# Altium schematic sheet 07_MOTOR_DRIVER_INTERFACE.SchDoc
size A4
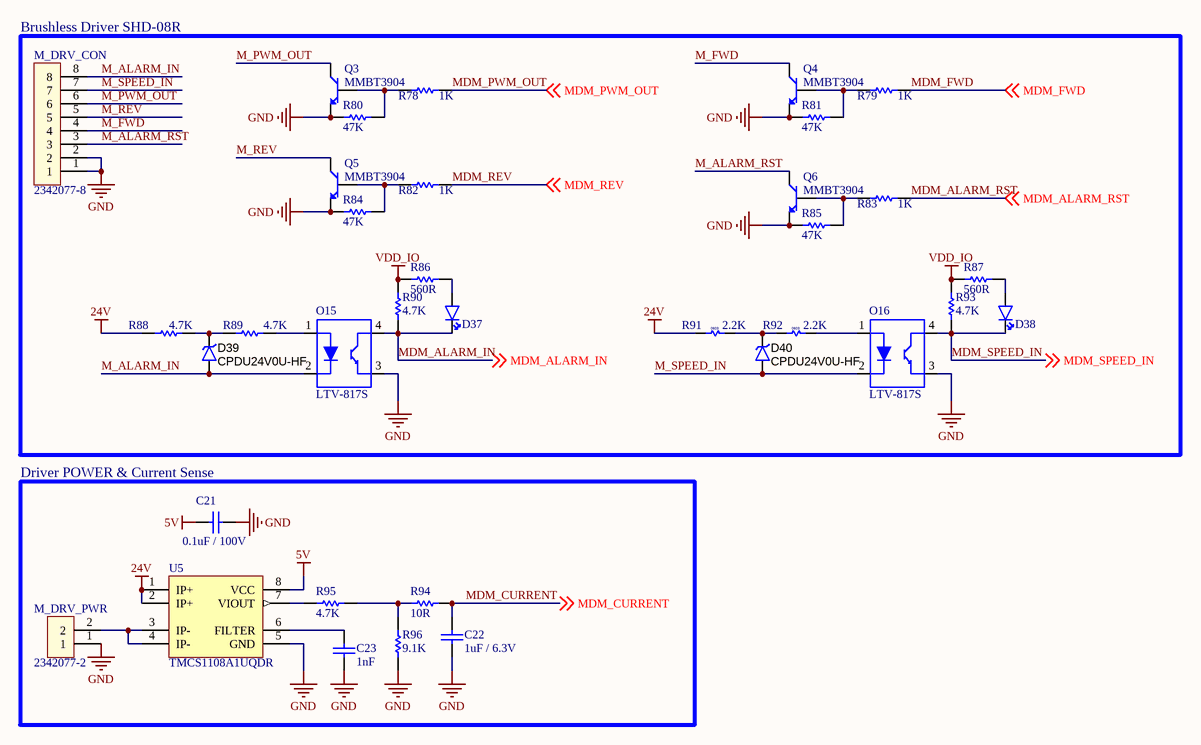
[diagram p0: 07_MOTOR_DRIVER_INTERFACE.SchDoc]

## Parts
C21  0.1uF / 100V  [603C]
C22  1uF / 6.3V  [603C]
C23  1nF  [603C]
D37  led_green  [805LED]  (value not drawn)
D38  led_green  [805LED]  (value not drawn)
D39  CPDU24V0U-HF  [SOD523F]
D40  CPDU24V0U-HF  [SOD523F]
M_DRV_CON  2342077-8  [TERM BLOCK HDR 8POS 90DEG PITCH 3.81MM]
M_DRV_PWR  2342077-2  [TERM BLOCK HDR 2POS 90DEG PITCH 3.81MM]
O15  LTV-817S  [SMD4-2.54-4.6X6.5MM]
O16  LTV-817S  [SMD4-2.54-4.6X6.5MM]
Q3  MMBT3904  [ONSC-SOT-23-3-318-08_V]
Q4  MMBT3904  [ONSC-SOT-23-3-318-08_V]
Q5  MMBT3904  [ONSC-SOT-23-3-318-08_V]
Q6  MMBT3904  [ONSC-SOT-23-3-318-08_V]
R78  1K  [603R]
R79  1K  [603R]
R80  47K  [603R]
R81  47K  [603R]
R82  1K  [603R]
R83  1K  [603R]
R84  47K  [603R]
R85  47K  [603R]
R86  560R  [603R]
R87  560R  [603R]
R88  4.7K  [603R]
R89  4.7K  [603R]
R90  4.7K  [603R]
R91  2.2K  [603R]
R92  2.2K  [603R]
R93  4.7K  [603R]
R94  10R  [603R]
R95  4.7K  [603R]
R96  9.1K  [603R]
U5  TMCS1108A1UQDR  [ACS712]

## Blocks framed on the sheet
Brushless Driver SHD-08R: D37-D40 M_DRV_CON O15 O16 Q3-Q6 R78-R93
Driver POWER & Current Sense: C21-C23 M_DRV_PWR R94-R96 U5

## Nets
5V: C21.1 U5.8(VCC)
24V: R88.1 R91.1 U5.1(IP+) U5.2(IP+)
GND: C21.2 C22.1 C23.1 M_DRV_CON.1 M_DRV_CON.2 M_DRV_PWR.1 O15.3(EMITER) O16.3(EMITER) Q3.2(E) Q4.2(E) Q5.2(E) Q6.2(E) R80.1 R81.1 R84.1 R85.1 R96.1 U5.5(GND)
VDD_IO: R86.2 R87.2 R90.2 R93.2
M_ALARM_IN: D39.1 M_DRV_CON.8 O15.2(CATHODE)
M_ALARM_RST: M_DRV_CON.3 Q6.3(C)
M_FWD: M_DRV_CON.4 Q4.3(C)
M_PWM_OUT: M_DRV_CON.6 Q3.3(C)
M_REV: M_DRV_CON.5 Q5.3(C)
M_SPEED_IN: D40.1 M_DRV_CON.7 O16.2(CATHODE)
MDM_ALARM_IN: D37.2(K) O15.4(COLLECTOR) R90.1 ; off-sheet MDM_ALARM_IN
MDM_ALARM_RST: R83.2 ; off-sheet MDM_ALARM_RST
MDM_CURRENT: C22.2 R94.2 ; off-sheet MDM_CURRENT
MDM_FWD: R79.2 ; off-sheet MDM_FWD
MDM_PWM_OUT: R78.2 ; off-sheet MDM_PWM_OUT
MDM_REV: R82.2 ; off-sheet MDM_REV
MDM_SPEED_IN: D38.2(K) O16.4(COLLECTOR) R93.1 ; off-sheet MDM_SPEED_IN
NetC23_2: C23.2 U5.6(FILTER)
NetD37_1: D37.1(A) R86.1
NetD38_1: D38.1(A) R87.1
NetD39_2: D39.2 R88.2 R89.1
NetD40_2: D40.2 R91.2 R92.1
NetM_DRV_PWR_2: M_DRV_PWR.2 U5.3(IP-) U5.4(IP-)
NetO15_1: O15.1(ANODE) R89.2
NetO16_1: O16.1(ANODE) R92.2
NetQ3_1: Q3.1(B) R78.1 R80.2
NetQ4_1: Q4.1(B) R79.1 R81.2
NetQ5_1: Q5.1(B) R82.1 R84.2
NetQ6_1: Q6.1(B) R83.1 R85.2
NetR94_1: R94.1 R95.1 R96.2
NetR95_2: R95.2 U5.7(VIOUT)

## Notes on the sheet
- (in symbol RES 2.2K OHM 5% 1/10W 0603) 0603

## Library data of the parts
C21 = CAP CER 0.1UF 100V X7R 0603: 0.1 µF ±10% 100V Ceramic Capacitor X7R 0603 (1608 Metric); Manufacturer: Venkel; Manufacturer Part Number: C0603X7R101-104KNP; Value: 0.1uF / 100V; Digi-Key Part Number: 2679-C0603X7R101-104KNPTR-ND; Tolerance: ±10%; Voltage - Rated: 100V; Temperature Coefficient: X7R; Operating Temperature: -55°C ~ 125°C; Applications: General Purpose; Package / Case: 0603 (1608 Metric)
C22 = CAP_CER 1UF 6.3V X5R 0603: 1µF ±10% 6.3V Ceramic Capacitor X5R 0603 (1608 Metric); Manufacturer: Samsung Electro-Mechanics; Manufacturer Part Number: CL10A105KQ8NNNC; Value: 1uF / 6.3V; Digi-Key Part Number: 1276-1036-1-ND; Tolerance: ±10%; Voltage - Rated: 6.3V; Temperature Coefficient: X5R; Operating Temperature: -55°C ~ 85°C; Applications: General Purpose; Package / Case: 0603 (1608 Metric)
C23 = CAP_CER_1nF_50V_%5_ X7R_ 0603: 1nF ±5% 50V Ceramic Capacitor X7R 0603 (1608 Metric); Manufacturer: Yageo; Manufacturer Part Number: CC0603JRX7R9BB102; Value: 1nF; Digi-Key Part Number: 311-3361-2-ND; Tolerance: ±5%; Voltage - Rated: 50V; Temperature Coefficient: X7R; Operating Temperature: -55°C ~ 125°C; Applications: General Purpose; Package / Case: 0603 (1608 Metric); Size / Dimension: 0.063" L x 0.032" W (1.60mm x 0.80mm); Thickness (Max): 0.035" (0.90mm)
D37 D38 = LED_GREEN_0805: LED 2X1.2MM 570NM GN WTR CLR SMD; Millicandela Rating: 50mcd; Voltage - Forward (Vf): 2.1V; value: led_green; Digi-Key Part Number: 754-1127-1-ND; Case: 0805; Viewing Angle: -
D39 D40 = TVS DIODE 24VWM 50V 0603/SOD523F CPDU24V0U-HF: 50V Clamp 3A (8/20µs) Ipp Tvs Diode Surface Mount 0603/SOD-523F; Manufacturer: Comchip Technology; Type: Zener; Voltage - Reverse Standoff (Typ): 24V (Max); Voltage - Breakdown (Min): 26.5V; Power - Peak Pulse: 150W; Power Line Protection: No; Unidirectional Channels: 1; Digi-Key Part Number: 641-1679-1-ND; Manufacturer Part Number: CPDU24V0U-HF; Voltage - Clamping (Max) @ Ipp: 50V; Operating Temperature: -55°C ~ 125°C (TJ); Package / Case: 0603/SOD-523F; Value: CPDU24V0U-HF
M_DRV_CON = TERM BLOCK HDR 8POS 90DEG 3.81MM: 8 Position Terminal Block Header, Male Pins, Shrouded (4 Side) 0.150" (3.81mm) 90°, Right Angle - Through Hole; Manufacturer: TE Connectivity AMP Connectors; Contact Tail Length: 0.075" (1.90mm); Digi-Key Part Number: A145326-ND; Value: 2342077-8; Pitch: 0.150" (3.81mm); Header Orientation: 90°, Right Angle; Insulation Height: 0.285" (7.25mm)
M_DRV_PWR = TERM BLOCK HDR 2POS 90DEG 3.81MM: 2 Position Terminal Block Header, Male Pins, Shrouded (4 Side) 0.150" (3.81mm) 90°, Right Angle - Through Hole; Manufacturer: TE Connectivity AMP Connectors; Contact Tail Length: 0.075" (1.90mm); Digi-Key Part Number: A145321-ND; Value: 2342077-2; Pitch: 0.150" (3.81mm); Header Orientation: 90°, Right Angle; Insulation Height: 0.285" (7.25mm)
O15 O16 = OPTOISOLATR 5KV TRANSISTOR 4-SMD LTV-817S: Optoisolator Transistor Output 5000Vrms 1 Channel 4-SMD; Voltage - Output (Max): 35V; Number of Channels: 1; Rise / Fall Time (Typ): 4µs, 3µs; Current - DC Forward (If) (Max): 50 mA; Voltage - Forward (Vf) (Typ): 1.2V; Output Type: Transistor; Voltage - Isolation: 5000Vrms; Package / Case: 4-SMD, Gull Wing; Operating Temperature: -30°C ~ 110°C; Value: LTV-817S; Digi-Key Part Number: 160-1367-5-ND
Q3-Q6 = NPN_BT3904: Bipolar (BJT) Transistor NPN 40V 200mA 300MHz 300mW Surface Mount SOT-23-3 (TO-236); Manufacturer: ON Semiconductor; Manufacturer Part Number: MMBT3904LT3G; MAX  Voltage / Current: 40V /200mA; DC Current Gain (hFE) (Min) @ Ic, Vce: 100 @ 10mA, 1V; Vce Saturation (Max) @ Ib, Ic: 300mV @ 5mA, 50mA; value: MMBT3904; Digi-Key Part Number: MMBT3904LT3GOSTR-ND; Package / Case: TO-236-3, SC-59, SOT-23-3; Power - Max: 300mW; Frequency - Transition: 300MHz; Transistor Type: NPN; Current - Collector (Ic) (Max): 200mA; Voltage - Collector Emitter Breakdown (Max): 40V; Operating Temperature: -55°C ~ 150°C (TJ); Supplier Device Package: SOT-23-3 (TO-236)
R78 R79 R82 R83 = RES_1K_OHM_%5_0.1W_0603: 1 kOhms ±5% 0.1W, 1/10W Chip Resistor 0603 (1608 Metric) Moisture Resistant Thick Film; Manufacturer: Yageo; Manufacturer Part Number: RC0603JR-071KL; Temperature Coefficient: ±100ppm/°C; Value: 1K; Digi-Key Part Number: 311-1.0KGRTR-ND; Tolerance: ±5%; Power (Watts): 0.1W, 1/10W; Composition: Thick Film; Operating Temperature: -55°C ~ 155°C; Package / Case: 0603 (1608 Metric); Size / Dimension: 0.063" L x 0.032" W (1.60mm x 0.80mm); Height - Seated (Max): 0.022" (0.55mm); Features: Moisture Resistant
R80 R81 R84 R85 = RES_47K_OHM_%5_0.1W_0603: 47 kOhms ±5% 0.1W, 1/10W Chip Resistor 0603 (1608 Metric) Moisture Resistant Thick Film; Manufacturer: Yageo; Manufacturer Part Number: RC0603JR-0747KL; Temperature Coefficient: ±100ppm/°C; Value: 47K; Digi-Key Part Number: 311-47KGRTR-ND; Tolerance: ±5%; Power (Watts): 0.1W, 1/10W; Composition: Thick Film; Operating Temperature: -55°C ~ 155°C; Package / Case: 0603 (1608 Metric); Size / Dimension: 0.063" L x 0.032" W (1.60mm x 0.80mm); Height - Seated (Max): 0.022" (0.55mm); Features: Moisture Resistant
R86 R87 = RES_560_OHM_%5_0.1W_0603: 560 Ohms ±5% 0.1W, 1/10W Chip Resistor 0603 (1608 Metric) Moisture Resistant Thick Film; Manufacturer: Yageo; Manufacturer Part Number: RC0603JR-07560RL; Temperature Coefficient: ±100ppm/°C; Value: 560R; Digi-Key Part Number: 311-560GRCT-ND; Tolerance: ±5%; Power (Watts): 0.1W, 1/10W; Composition: Thick Film; Operating Temperature: -55°C ~ 155°C; Package / Case: 0603 (1608 Metric); Size / Dimension: 0.063" L x 0.032" W (1.60mm x 0.80mm); Height - Seated (Max): 0.022" (0.55mm); Features: Moisture Resistant
R88-R90 R93 = RES_4.7K_OHM_%5_0.1W_0603: 4.7 kOhms ±5% 0.1W, 1/10W Chip Resistor 0603 (1608 Metric) Moisture Resistant Thick Film; Manufacturer: Yageo; Manufacturer Part Number: RC0603JR-074K7L; Temperature Coefficient: ±100ppm/°C; Value: 4.7K; Digi-Key Part Number: 311-4.7KGRTR-ND; Tolerance: ±5%; Power (Watts): 0.1W, 1/10W; Composition: Thick Film; Operating Temperature: -55°C ~ 155°C; Package / Case: 0603 (1608 Metric); Size / Dimension: 0.063" L x 0.032" W (1.60mm x 0.80mm); Height - Seated (Max): 0.022" (0.55mm); Features: Moisture Resistant
R91 R92 = RES 2.2K OHM 5% 1/10W 0603: 2.2 kOhms ±5% 0.1W, 1/10W Chip Resistor 0603 (1608 Metric) Automotive AEC-Q200 Thick Film; Temperature Coefficient: ±200ppm/°C; Value: 2.2K; Digi-Key Part Number: RMCF0603JT2K20TR-ND; Tolerance: ±5%; Power (Watts): 0.1W, 1/10W; Operating Temperature: -55°C ~ 155°C; Package / Case: 0603 (1608 Metric)
R94 = RES_10_OHM_%1_0.1W_0603: 10 Ohms ±1% 0.1W, 1/10W Chip Resistor 0603 (1608 Metric) Moisture Resistant Thick Film; Manufacturer: Yageo; Manufacturer Part Number: RC0603FR-0710RL; Temperature Coefficient: ±100ppm/°C; Value: 10R; Digi-Key Part Number: 311-10.0HRCT-ND; Tolerance: ±1%; Power (Watts): 0.1W, 1/10W; Composition: Thick Film; Operating Temperature: -55°C ~ 155°C; Package / Case: 0603 (1608 Metric); Size / Dimension: 0.063" L x 0.032" W (1.60mm x 0.80mm); Height - Seated (Max): 0.022" (0.55mm); Features: Moisture Resistant
R95 = RES SMD 4.7K OHM 1% 1/10W 0603: 4.7 kOhms ±1% 0.1W, 1/10W Chip Resistor 0603 (1608 Metric)  Thick Film; Temperature Coefficient: ±100ppm/°C; Value: 4.7K; Digi-Key Part Number: 311-4.70KHRCT-ND; Tolerance: ±1%; Power (Watts): 0.1W, 1/10W; Operating Temperature: -55°C ~ 155°C; Package / Case: 0603 (1608 Metric)
R96 = RES 9.1K OHM 5% 1/10W 0603: 9.1 kOhms ±5% 0.1W, 1/10W Chip Resistor 0603 (1608 Metric) Moisture Resistant Thick Film; Manufacturer: Yageo; Manufacturer Part Number: RC0603JR-079K1L; Temperature Coefficient: ±100ppm/°C; Value: 9.1K; Digi-Key Part Number: 311-9.1KGRCT-ND; Tolerance: ±5%; Power (Watts): 0.1W, 1/10W; Composition: Thick Film; Operating Temperature: -55°C ~ 155°C; Package / Case: 0603 (1608 Metric); Size / Dimension: 0.063" L x 0.032" W (1.60mm x 0.80mm); Height - Seated (Max): 0.022" (0.55mm); Features: Moisture Resistant
U5 = 100-V HALL-EFFECT CURRENT SENSOR TMCS1108A1UQDR: Current Sensor - 1 Channel Hall Effect Unidirectional 8-SOIC (0.154", 3.90mm Width); Manufacturer: Texas Instruments; For Measuring: DC; Current - Sensing (3V ~5V): 30 ~50A; Voltage - Supply: 3V ~ 5.5V; Frequency: DC ~ 80kHz; Sensitivity: 50mV/A; Output: Ratiometric, Voltage; Digi-Key Part Number: 296-TMCS1108A1UQDRCT-ND; Sensor Type: Hall Effect; Operating Temperature: -40°C ~ 125°C (TA); Package / Case: 8-SOIC (0.154", 3.90mm Width); Polarization: Unidirectional; Manufacturer Part Number: TMCS1108A1UQDR; Value: TMCS1108A1UQDR